# Altium schematic sheet GD_Tcontroller_Sensor.SchDoc
size A4
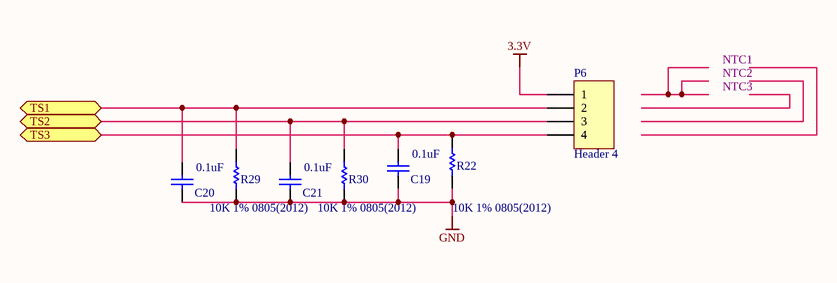
[diagram p0: GD_Tcontroller_Sensor.SchDoc]

## Parts
C19  value 0.1uF  [CAPC0805(2012)100_N]  (hidden comment: CAP 0.1uF 50V 0805(2012))
C20  value 0.1uF  [CAPC0805(2012)100_N]  (hidden comment: CAP 0.1uF 50V 0805(2012))
C21  value 0.1uF  [CAPC0805(2012)100_N]  (hidden comment: CAP 0.1uF 50V 0805(2012))
P6  Header 4  [HT5.08-4P-H]
R22  10K 1% 0805(2012)  [RESC0805(2012)_L]  (no BOM)
R29  10K 1% 0805(2012)  [RESC0805(2012)_L]  (no BOM)
R30  10K 1% 0805(2012)  [RESC0805(2012)_L]  (no BOM)

## Ports
TS1, TS2, TS3

## Nets
3.3V: P6.1
GND: C19.1 C20.1 C21.1 R22.2 R29.2 R30.2
TS1: C20.2 P6.2 R29.1 ; port TS1
TS2: C21.2 P6.3 R30.1 ; port TS2
TS3: C19.2 P6.4 R22.1 ; port TS3

## Notes on the sheet
- NTC1
- NTC2
- NTC3

## Library data of the parts
C19-C21 = CMP-1036-00070-1: CAP 0.1uF 50V ±20% 0805 (2012 Metric) Thickness 1mm SMD; Case-Metric: 2012; Case-EIA: 0805; Tolerance: 20%; Rated Voltage: 50 V; Technology: SMT; Max Thickness: 1 mm
P6 = Header 4: Header, 4-Pin; LatestRevisionDate: 17-Jul-2002; LatestRevisionNote: Re-released for DXP Platform.; Publisher: Altium Limited
R22 R29 R30 = CMP-1013-00098-1: 10K 0.125W 5% 0805 (2012 Metric)  SMD; Case-EIA: 0805; Case-Metric: 2012; Value: 10000.00 Ohm; Power: 0.125 W; Technology: SMT; Tolerance: 1 %